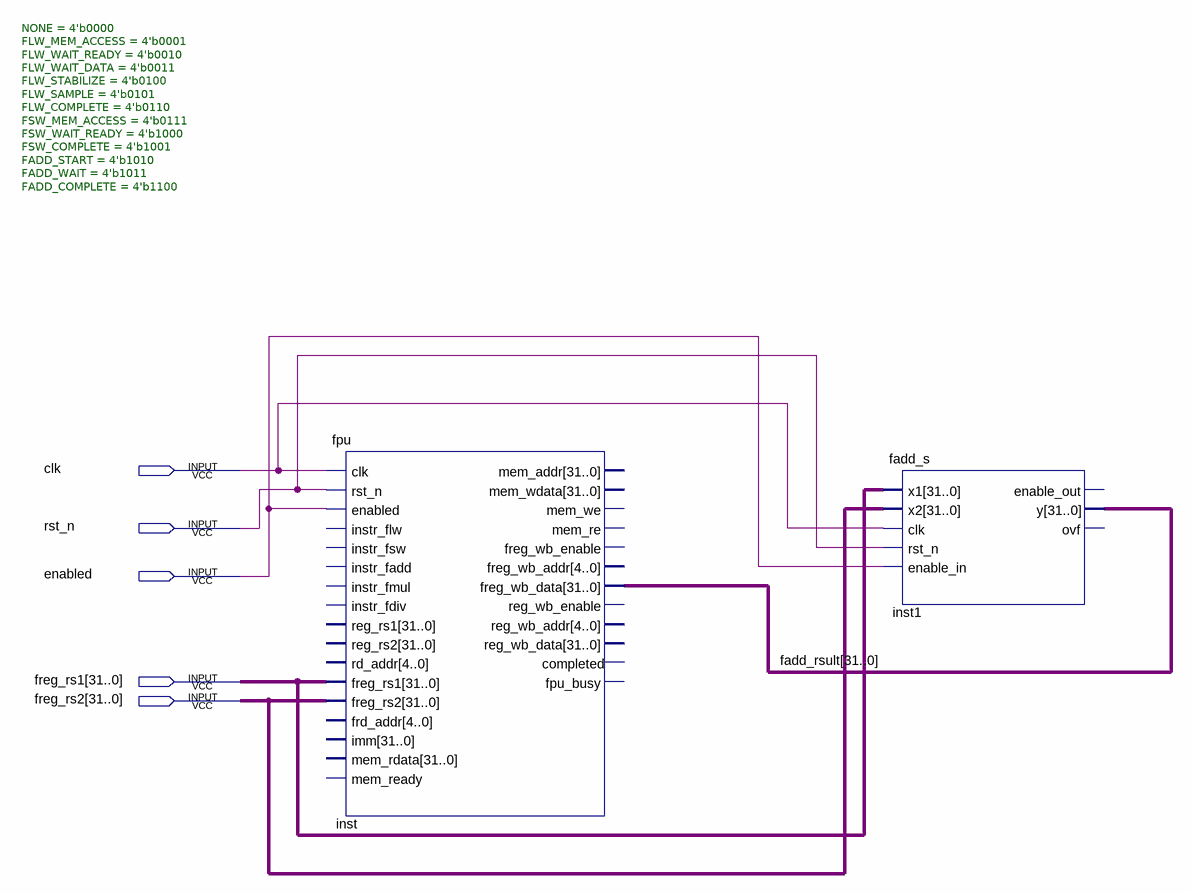
[diagram p0: schematic sheet]
// Quartus schematic Block1.bdf as structural Verilog: 2 symbols, 5 pins
module Block1 (
  input  clk,
  input  rst_n,
  input  enabled,
  input  [31:0] freg_rs1,
  input  [31:0] freg_rs2
);

  wire [31:0] fadd_rsult;

  fpu #(.NONE(4'b0000), .FLW_MEM_ACCESS(4'b0001), .FLW_WAIT_READY(4'b0010), .FLW_WAIT_DATA(4'b0011), .FLW_STABILIZE(4'b0100), .FLW_SAMPLE(4'b0101), .FLW_COMPLETE(4'b0110), .FSW_MEM_ACCESS(4'b0111), .FSW_WAIT_READY(4'b1000), .FSW_COMPLETE(4'b1001), .FADD_START(4'b1010), .FADD_WAIT(4'b1011), .FADD_COMPLETE(4'b1100)) inst (
    .clk(clk), .rst_n(rst_n), .enabled(enabled), .freg_rs1(freg_rs1), .freg_rs2(freg_rs2),
    .freg_wb_data(fadd_rsult));  // open: instr_flw, instr_fsw, instr_fadd, instr_fmul, instr_fdiv, reg_rs1, reg_rs2, rd_addr, frd_addr, imm, mem_rdata, mem_ready, mem_addr, mem_wdata, mem_we, mem_re, freg_wb_enable, freg_wb_addr, reg_wb_enable, reg_wb_addr, reg_wb_data, completed, fpu_busy
  fadd_s inst1 (
    .x1(freg_rs1), .x2(freg_rs2), .clk(clk), .rst_n(rst_n), .enable_in(enabled), .y(fadd_rsult));  // open: enable_out, ovf
endmodule
